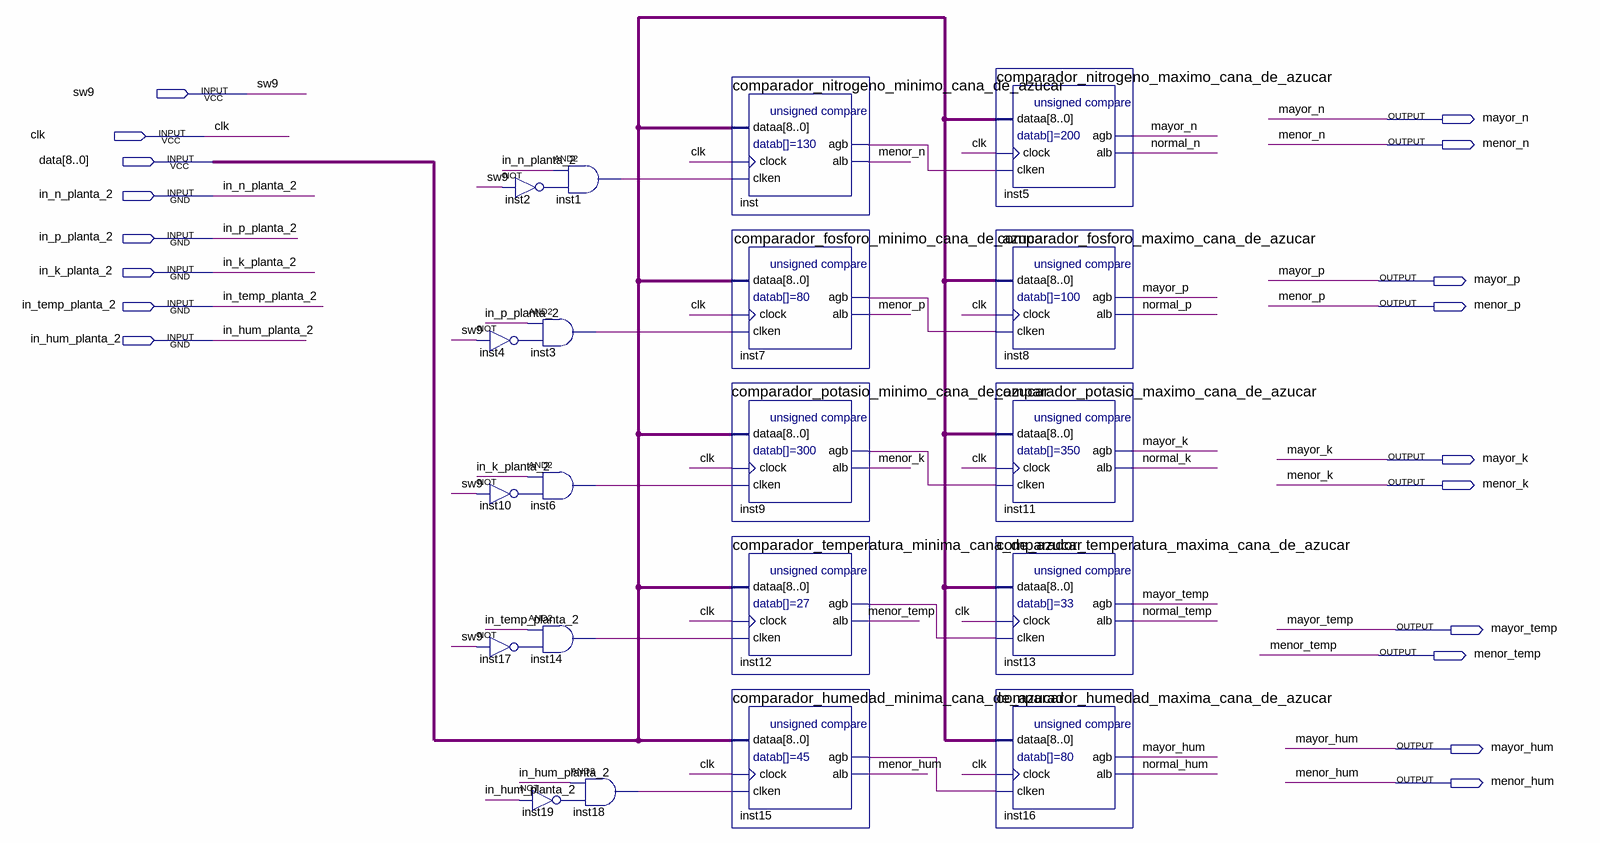
[diagram p0: schematic sheet]
// Quartus schematic Comparador_planta_2.bdf as structural Verilog: 20 symbols, 18 pins
module Comparador_planta_2 (
  input  sw9,
  input  clk,
  input  [8:0] data,
  input  in_n_planta_2,
  input  in_p_planta_2,
  input  in_k_planta_2,
  input  in_temp_planta_2,
  input  in_hum_planta_2,
  output mayor_n,
  output menor_n,
  output mayor_p,
  output menor_p,
  output mayor_k,
  output menor_k,
  output mayor_temp,
  output menor_temp,
  output mayor_hum,
  output menor_hum
);

  wire inst1_out, inst2_out, inst3_out, inst4_out, inst6_out, inst7_agb, inst9_agb, inst10_out, inst12_agb,
       inst14_out, inst15_agb, inst17_out, inst18_out, inst19_out, inst_agb, normal_hum, normal_k, normal_n,
       normal_p, normal_temp;

  not inst2 (inst2_out, sw9);
  and inst3 (inst3_out, in_p_planta_2, inst4_out);
  not inst4 (inst4_out, sw9);
  and inst6 (inst6_out, in_k_planta_2, inst10_out);
  not inst10 (inst10_out, sw9);
  and inst14 (inst14_out, in_temp_planta_2, inst17_out);
  not inst17 (inst17_out, sw9);
  not inst19 (inst19_out, in_hum_planta_2);
  and inst1 (inst1_out, in_n_planta_2, inst2_out);
  and inst18 (inst18_out, in_hum_planta_2, inst19_out);
  comparador_nitrogeno_minimo_cana_de_azucar inst (
    .dataa(data), .clock(clk), .clken(inst1_out), .agb(inst_agb), .alb(menor_n));
  comparador_fosforo_minimo_cana_de_azucar inst7 (
    .dataa(data), .clock(clk), .clken(inst3_out), .agb(inst7_agb), .alb(menor_p));
  comparador_potasio_minimo_cana_de_azucar inst9 (
    .dataa(data), .clock(clk), .clken(inst6_out), .agb(inst9_agb), .alb(menor_k));
  comparador_temperatura_minima_cana_de_azucar inst12 (
    .dataa(data), .clock(clk), .clken(inst14_out), .agb(inst12_agb), .alb(menor_temp));
  comparador_humedad_minima_cana_de_azucar inst15 (
    .dataa(data), .clock(clk), .clken(inst18_out), .agb(inst15_agb), .alb(menor_hum));
  comparador_nitrogeno_maximo_cana_de_azucar inst5 (
    .dataa(data), .clock(clk), .clken(inst_agb), .agb(mayor_n), .alb(normal_n));
  comparador_fosforo_maximo_cana_de_azucar inst8 (
    .dataa(data), .clock(clk), .clken(inst7_agb), .agb(mayor_p), .alb(normal_p));
  comparador_potasio_maximo_cana_de_azucar inst11 (
    .dataa(data), .clock(clk), .clken(inst9_agb), .agb(mayor_k), .alb(normal_k));
  comparador_temperatura_maxima_cana_de_azucar inst13 (
    .dataa(data), .clock(clk), .clken(inst12_agb), .agb(mayor_temp), .alb(normal_temp));
  comparador_humedad_maxima_cana_de_azucar inst16 (
    .dataa(data), .clock(clk), .clken(inst15_agb), .agb(mayor_hum), .alb(normal_hum));
endmodule
